# EAGLE schematic Battery_connector (EAGLE 7.2.0)
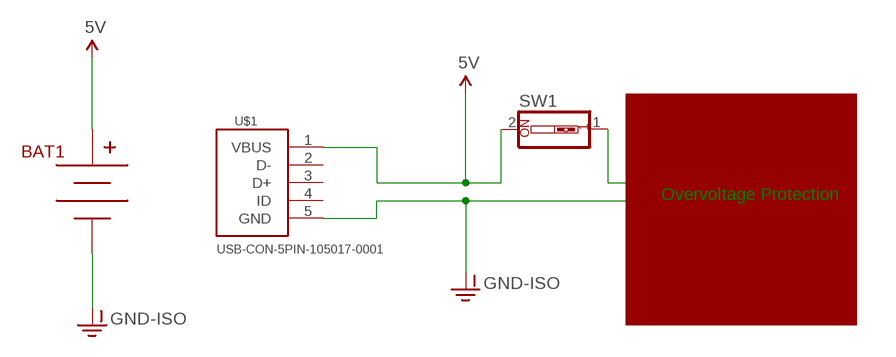
[diagram p0: schematic, sheet 1]

## Parts
BAT1  BC9VPC  [BC9VPC]
SW1  SW_DIP-1  [EDG-01]
U$1  USB-CON-5PIN-105017-0001  [USB-MICRO-MOLEX-105017-0001]

## Nets
5V: BAT1.V+ SW1.2 U$1.1(VBUS)
GND-ISO: BAT1.V- U$1.5(GND)
N$1: SW1.1
Unconnected: U$1.2(D-) U$1.3(D+) U$1.4(ID)

## Notes on the sheet
- Overvoltage Protection

## Library data of the parts
BAT1 = SparkFun-Connectors:BC9VPC: 9V board-mount battery cradle; PROD_ID: BATT-10855
SW1 = special:SW_DIP-1: DIP SWITCH
U$1 = GeekAmmo:USB-CON-5PIN: Molex Micro USB 105017-0001